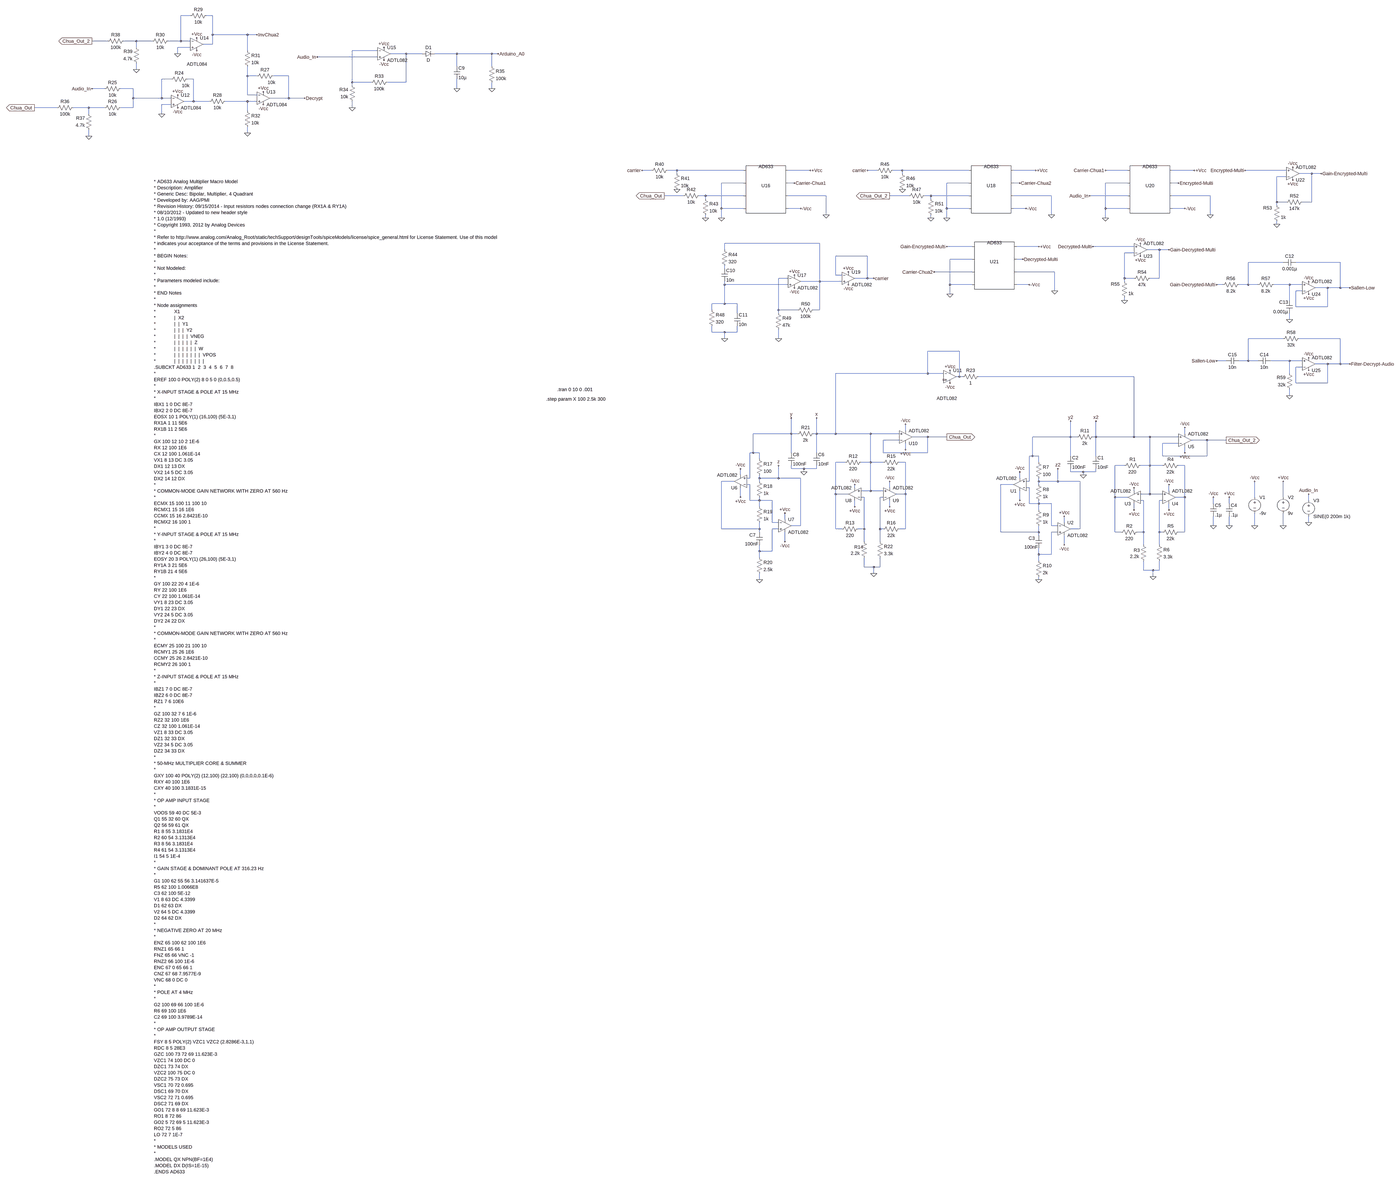
[diagram p0: schematic Chua.asc, whole sheet]
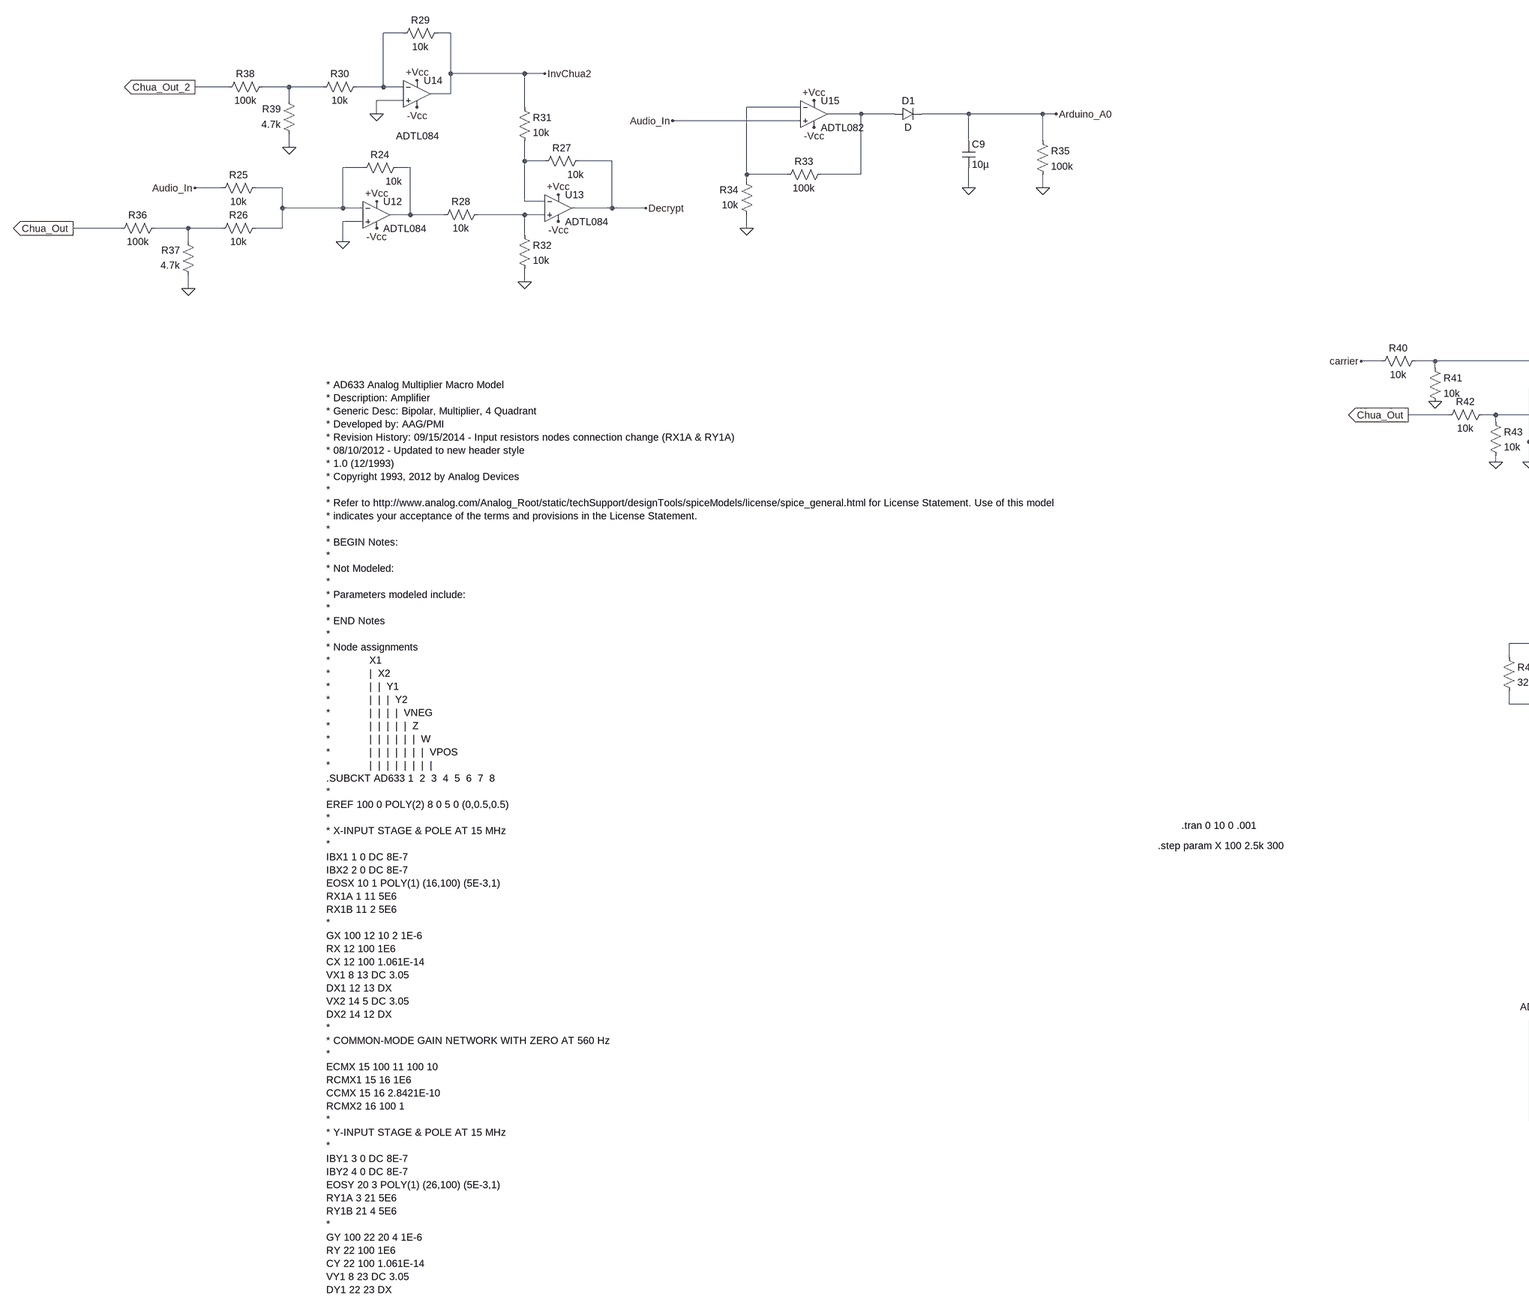
[diagram p1: schematic Chua.asc, part, row 1 of 2, column 1 of 2]
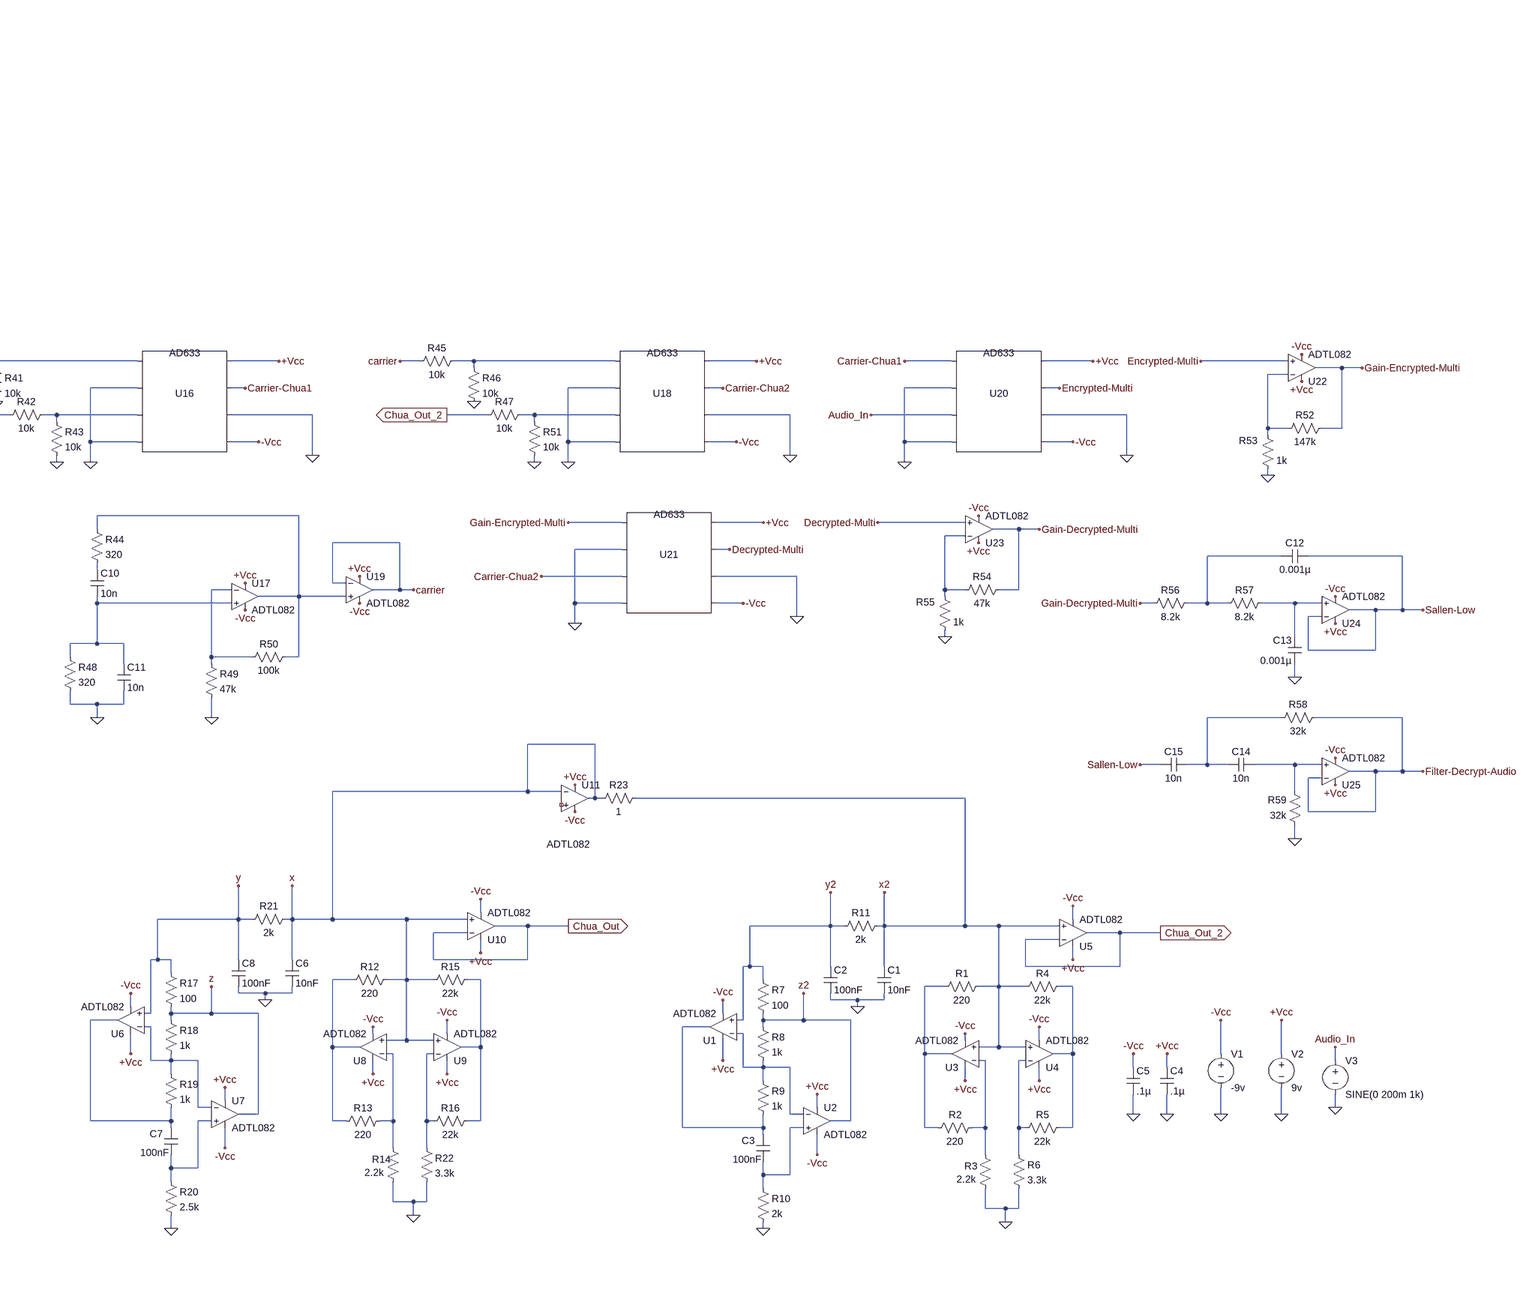
[diagram p2: schematic Chua.asc, part, row 1 of 2, column 2 of 2]
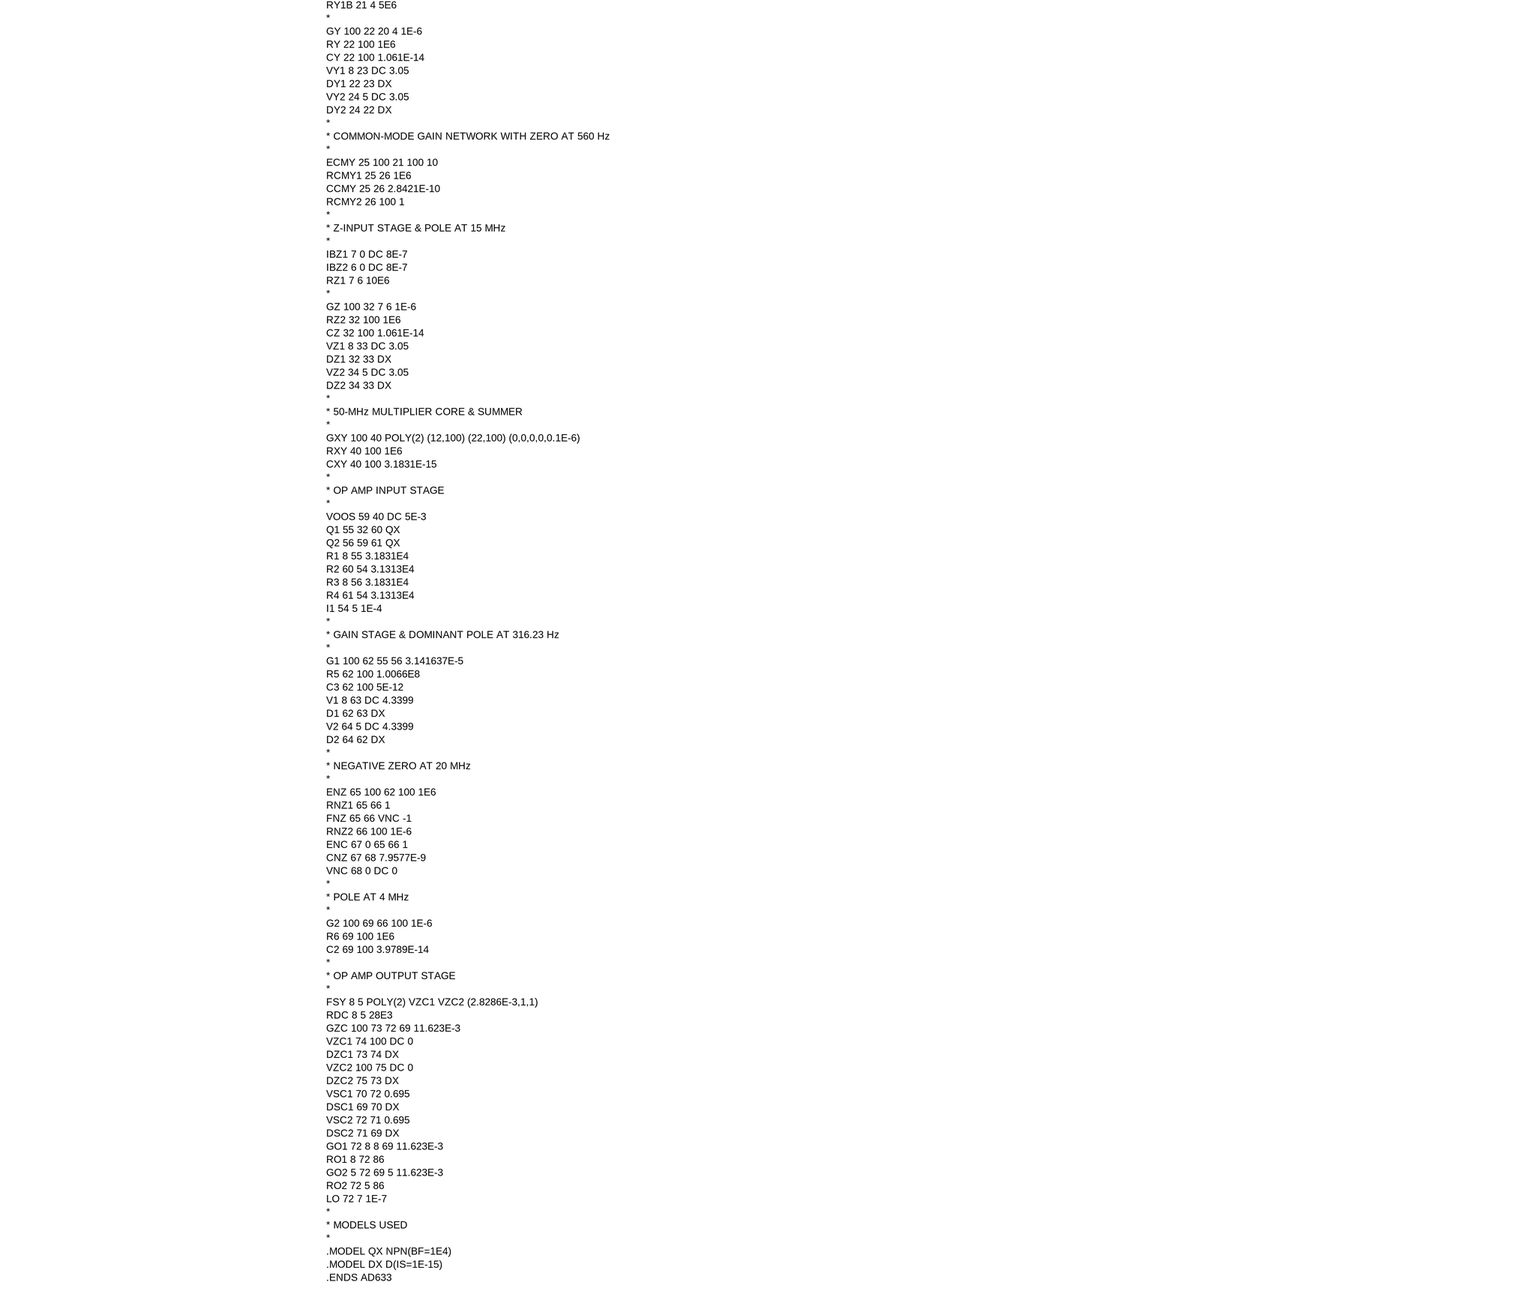
[diagram p3: schematic Chua.asc, part, row 2 of 2, column 1 of 2]
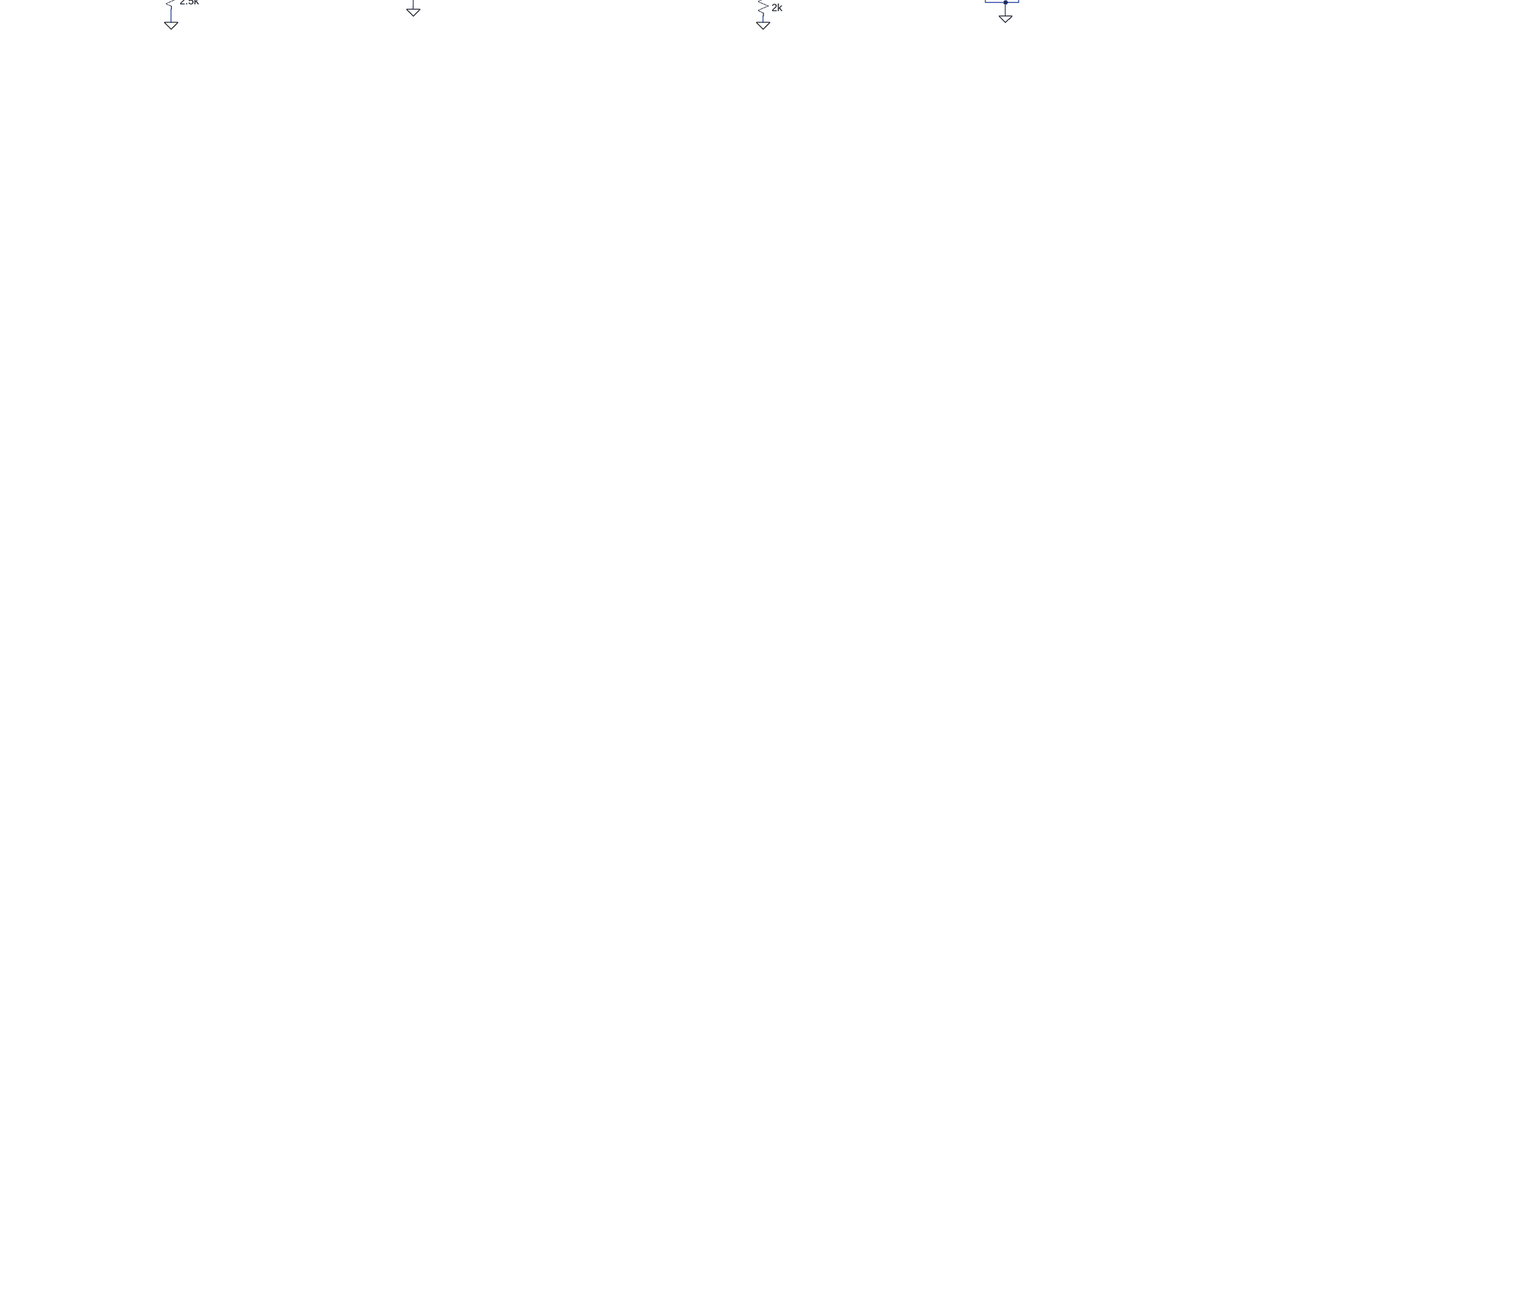
[diagram p4: schematic Chua.asc, part, row 2 of 2, column 2 of 2]
Chua.asc, the LTspice schematic file:
Version 4.1
SHEET 1 1936 3184
WIRE -5456 -2448 -5504 -2448
WIRE -5344 -2448 -5376 -2448
WIRE -5344 -2352 -5344 -2448
WIRE -5168 -2352 -5344 -2352
WIRE -5120 -2352 -5168 -2352
WIRE -5872 -2320 -5952 -2320
WIRE -5728 -2320 -5792 -2320
WIRE -5648 -2320 -5728 -2320
WIRE -5504 -2320 -5504 -2448
WIRE -5504 -2320 -5568 -2320
WIRE -5456 -2320 -5504 -2320
WIRE -5344 -2304 -5344 -2352
WIRE -5344 -2304 -5392 -2304
WIRE -5728 -2288 -5728 -2320
WIRE -5456 -2288 -5520 -2288
WIRE -5168 -2272 -5168 -2352
WIRE -4512 -2272 -4640 -2272
WIRE -5520 -2256 -5520 -2288
WIRE -4368 -2256 -4448 -2256
WIRE -4288 -2256 -4368 -2256
WIRE -4112 -2256 -4224 -2256
WIRE -3936 -2256 -4112 -2256
WIRE -3904 -2256 -3936 -2256
WIRE -4512 -2240 -4816 -2240
WIRE -4112 -2192 -4112 -2256
WIRE -3936 -2192 -3936 -2256
WIRE -5728 -2176 -5728 -2208
WIRE -5168 -2144 -5168 -2192
WIRE -5120 -2144 -5168 -2144
WIRE -4960 -2144 -5040 -2144
WIRE -5552 -2128 -5600 -2128
WIRE -5440 -2128 -5472 -2128
WIRE -4640 -2112 -4640 -2272
WIRE -4544 -2112 -4640 -2112
WIRE -4368 -2112 -4368 -2256
WIRE -4368 -2112 -4464 -2112
WIRE -4640 -2096 -4640 -2112
WIRE -5888 -2080 -5952 -2080
WIRE -5744 -2080 -5808 -2080
WIRE -4112 -2080 -4112 -2128
WIRE -3936 -2080 -3936 -2112
WIRE -5168 -2048 -5168 -2144
WIRE -5120 -2048 -5168 -2048
WIRE -5744 -2032 -5744 -2080
WIRE -5600 -2032 -5600 -2128
WIRE -5600 -2032 -5744 -2032
WIRE -5552 -2032 -5600 -2032
WIRE -4960 -2032 -4960 -2144
WIRE -4960 -2032 -5056 -2032
WIRE -4880 -2032 -4960 -2032
WIRE -5440 -2016 -5440 -2128
WIRE -5440 -2016 -5488 -2016
WIRE -5360 -2016 -5440 -2016
WIRE -5168 -2016 -5280 -2016
WIRE -5120 -2016 -5168 -2016
WIRE -5552 -2000 -5600 -2000
WIRE -6128 -1984 -6272 -1984
WIRE -5968 -1984 -6048 -1984
WIRE -5888 -1984 -5968 -1984
WIRE -5744 -1984 -5744 -2032
WIRE -5744 -1984 -5808 -1984
WIRE -4640 -1984 -4640 -2016
WIRE -5168 -1968 -5168 -2016
WIRE -5968 -1952 -5968 -1984
WIRE -5600 -1952 -5600 -2000
WIRE -5168 -1856 -5168 -1888
WIRE -5968 -1840 -5968 -1872
WIRE -1840 -1552 -1888 -1552
WIRE -1712 -1552 -1760 -1552
WIRE -1376 -1552 -1712 -1552
WIRE -1040 -1552 -1152 -1552
WIRE -704 -1552 -752 -1552
WIRE -576 -1552 -624 -1552
WIRE -240 -1552 -576 -1552
WIRE 96 -1552 -16 -1552
WIRE 560 -1552 448 -1552
WIRE 896 -1552 784 -1552
WIRE 1360 -1552 1152 -1552
WIRE -1712 -1536 -1712 -1552
WIRE -576 -1536 -576 -1552
WIRE 1488 -1536 1424 -1536
WIRE 1536 -1536 1488 -1536
WIRE 1360 -1520 1312 -1520
WIRE -1376 -1488 -1488 -1488
WIRE -1120 -1488 -1152 -1488
WIRE -240 -1488 -352 -1488
WIRE 16 -1488 -16 -1488
WIRE 560 -1488 448 -1488
WIRE 816 -1488 784 -1488
WIRE -1680 -1424 -1776 -1424
WIRE -1568 -1424 -1600 -1424
WIRE -1376 -1424 -1568 -1424
WIRE -960 -1424 -1152 -1424
WIRE -544 -1424 -640 -1424
WIRE -432 -1424 -464 -1424
WIRE -240 -1424 -432 -1424
WIRE 176 -1424 -16 -1424
WIRE 560 -1424 368 -1424
WIRE 976 -1424 784 -1424
WIRE -1568 -1408 -1568 -1424
WIRE -432 -1408 -432 -1424
WIRE 1312 -1392 1312 -1520
WIRE 1360 -1392 1312 -1392
WIRE 1488 -1392 1488 -1536
WIRE 1488 -1392 1440 -1392
WIRE 1312 -1376 1312 -1392
WIRE -1488 -1360 -1488 -1488
WIRE -1376 -1360 -1488 -1360
WIRE -1088 -1360 -1152 -1360
WIRE -352 -1360 -352 -1488
WIRE -240 -1360 -352 -1360
WIRE 48 -1360 -16 -1360
WIRE 448 -1360 448 -1488
WIRE 560 -1360 448 -1360
WIRE 848 -1360 784 -1360
WIRE -960 -1328 -960 -1424
WIRE 176 -1328 176 -1424
WIRE 976 -1328 976 -1424
WIRE -1568 -1312 -1568 -1328
WIRE -1488 -1312 -1488 -1360
WIRE -432 -1312 -432 -1328
WIRE -352 -1312 -352 -1360
WIRE 448 -1312 448 -1360
WIRE 1312 -1280 1312 -1296
WIRE -992 -1184 -1472 -1184
WIRE -224 -1168 -352 -1168
WIRE 112 -1168 0 -1168
WIRE 592 -1168 384 -1168
WIRE -1472 -1152 -1472 -1184
WIRE 720 -1152 656 -1152
WIRE 768 -1152 720 -1152
WIRE 592 -1136 544 -1136
WIRE -752 -1120 -912 -1120
WIRE -224 -1104 -336 -1104
WIRE 32 -1104 0 -1104
WIRE 1344 -1088 1168 -1088
WIRE 1632 -1088 1408 -1088
WIRE -1472 -1056 -1472 -1072
WIRE -224 -1040 -416 -1040
WIRE 192 -1040 0 -1040
WIRE -912 -1024 -912 -1120
WIRE -880 -1024 -912 -1024
WIRE -1152 -1008 -1200 -1008
WIRE -752 -1008 -752 -1120
WIRE -752 -1008 -816 -1008
WIRE -720 -1008 -752 -1008
WIRE 544 -1008 544 -1136
WIRE 592 -1008 544 -1008
WIRE 720 -1008 720 -1152
WIRE 720 -1008 672 -1008
WIRE -992 -992 -992 -1184
WIRE -992 -992 -1088 -992
WIRE -880 -992 -992 -992
WIRE 544 -992 544 -1008
WIRE -1472 -976 -1472 -992
WIRE -1152 -976 -1472 -976
WIRE -336 -976 -336 -1104
WIRE -224 -976 -336 -976
WIRE 64 -976 0 -976
WIRE 1040 -976 1008 -976
WIRE 1168 -976 1168 -1088
WIRE 1168 -976 1120 -976
WIRE 1216 -976 1168 -976
WIRE 1376 -976 1296 -976
WIRE 1440 -976 1376 -976
WIRE 1568 -960 1504 -960
WIRE 1632 -960 1632 -1088
WIRE 1632 -960 1568 -960
WIRE 1680 -960 1632 -960
WIRE 192 -944 192 -1040
WIRE 1440 -944 1408 -944
WIRE -336 -928 -336 -976
WIRE 544 -896 544 -912
WIRE 1376 -896 1376 -976
WIRE -1472 -880 -1472 -976
WIRE -1472 -880 -1536 -880
WIRE -1408 -880 -1472 -880
WIRE 1408 -864 1408 -944
WIRE 1568 -864 1568 -960
WIRE 1568 -864 1408 -864
WIRE -1536 -848 -1536 -880
WIRE -1200 -848 -1200 -1008
WIRE -1104 -848 -1200 -848
WIRE -992 -848 -992 -992
WIRE -992 -848 -1024 -848
WIRE -1408 -832 -1408 -880
WIRE -1200 -832 -1200 -848
WIRE 1376 -800 1376 -832
WIRE -1536 -736 -1536 -768
WIRE -1472 -736 -1536 -736
WIRE -1408 -736 -1408 -768
WIRE -1408 -736 -1472 -736
WIRE -1472 -704 -1472 -736
WIRE -1200 -704 -1200 -752
WIRE 1344 -704 1168 -704
WIRE 1632 -704 1424 -704
WIRE -288 -640 -448 -640
WIRE 1056 -592 1008 -592
WIRE 1168 -592 1168 -704
WIRE 1168 -592 1120 -592
WIRE 1216 -592 1168 -592
WIRE 1376 -592 1280 -592
WIRE 1440 -592 1376 -592
WIRE 1568 -576 1504 -576
WIRE 1632 -576 1632 -704
WIRE 1632 -576 1568 -576
WIRE 1680 -576 1632 -576
WIRE 1440 -560 1408 -560
WIRE -448 -528 -448 -640
WIRE -448 -528 -912 -528
WIRE -368 -528 -448 -528
WIRE 1376 -528 1376 -592
WIRE -288 -512 -288 -640
WIRE -288 -512 -304 -512
WIRE -272 -512 -288 -512
WIRE 592 -512 -192 -512
WIRE 1408 -480 1408 -560
WIRE 1568 -480 1568 -576
WIRE 1568 -480 1408 -480
WIRE 1376 -416 1376 -448
WIRE -560 -240 -560 -272
WIRE -1136 -224 -1136 -304
WIRE -1136 -224 -1328 -224
WIRE -1104 -224 -1136 -224
WIRE -1008 -224 -1008 -304
WIRE -1008 -224 -1024 -224
WIRE -912 -224 -912 -528
WIRE -912 -224 -1008 -224
WIRE -736 -224 -912 -224
WIRE -592 -224 -736 -224
WIRE 848 -224 848 -256
WIRE -448 -208 -528 -208
WIRE -352 -208 -448 -208
WIRE 272 -208 272 -288
WIRE 272 -208 80 -208
WIRE 304 -208 272 -208
WIRE 400 -208 400 -288
WIRE 400 -208 384 -208
WIRE 592 -208 592 -512
WIRE 592 -208 400 -208
WIRE 672 -208 592 -208
WIRE 816 -208 672 -208
WIRE -592 -192 -672 -192
WIRE 960 -192 880 -192
WIRE 1056 -192 960 -192
WIRE 816 -176 736 -176
WIRE -560 -144 -560 -176
WIRE -1328 -128 -1328 -224
WIRE -1328 -128 -1344 -128
WIRE -1296 -128 -1328 -128
WIRE -1136 -128 -1136 -224
WIRE -1008 -128 -1008 -224
WIRE -672 -128 -672 -192
WIRE -448 -128 -448 -208
WIRE -448 -128 -672 -128
WIRE 848 -128 848 -160
WIRE 80 -112 80 -208
WIRE 80 -112 64 -112
WIRE 112 -112 80 -112
WIRE 272 -112 272 -208
WIRE 400 -112 400 -208
WIRE 736 -112 736 -176
WIRE 960 -112 960 -192
WIRE 960 -112 736 -112
WIRE -1296 -96 -1296 -128
WIRE -864 -80 -912 -80
WIRE -736 -80 -736 -224
WIRE -736 -80 -784 -80
WIRE -672 -80 -736 -80
WIRE -560 -80 -592 -80
WIRE 112 -80 112 -112
WIRE 544 -64 496 -64
WIRE 672 -64 672 -208
WIRE 672 -64 624 -64
WIRE 736 -64 672 -64
WIRE 848 -64 816 -64
WIRE -1136 -48 -1136 -64
WIRE -1072 -48 -1136 -48
WIRE -1008 -48 -1008 -64
WIRE -1008 -48 -1072 -48
WIRE -1072 -32 -1072 -48
WIRE 272 -32 272 -48
WIRE 336 -32 272 -32
WIRE 400 -32 400 -48
WIRE 400 -32 336 -32
WIRE -1392 -16 -1392 -48
WIRE 336 -16 336 -32
WIRE -1344 0 -1344 -128
WIRE -1344 0 -1360 0
WIRE -1296 0 -1296 -16
WIRE -1200 0 -1200 -64
WIRE -1200 0 -1296 0
WIRE -1088 0 -1200 0
WIRE 16 0 16 -32
WIRE -1424 16 -1488 16
WIRE -1296 16 -1296 0
WIRE 64 16 64 -112
WIRE 64 16 48 16
WIRE 112 16 112 0
WIRE 208 16 208 -48
WIRE 208 16 112 16
WIRE 320 16 208 16
WIRE -1344 32 -1360 32
WIRE -16 32 -80 32
WIRE 112 32 112 16
WIRE -816 48 -816 32
WIRE -640 48 -640 16
WIRE 64 48 48 48
WIRE -736 64 -736 -80
WIRE -736 64 -784 64
WIRE -672 64 -736 64
WIRE 592 64 592 48
WIRE 768 64 768 32
WIRE -912 80 -912 -80
WIRE -848 80 -912 80
WIRE -560 80 -560 -80
WIRE -560 80 -608 80
WIRE 672 80 672 -64
WIRE 672 80 624 80
WIRE 736 80 672 80
WIRE -1392 96 -1392 48
WIRE -768 96 -784 96
WIRE -672 96 -688 96
WIRE 496 96 496 -64
WIRE 560 96 496 96
WIRE 848 96 848 -64
WIRE 848 96 800 96
WIRE 1200 96 1200 16
WIRE 1344 96 1344 16
WIRE -1344 112 -1344 32
WIRE -1296 112 -1296 96
WIRE -1296 112 -1344 112
WIRE -1232 112 -1296 112
WIRE 16 112 16 64
WIRE 640 112 624 112
WIRE 736 112 720 112
WIRE 1472 112 1472 80
WIRE 64 128 64 48
WIRE 112 128 112 112
WIRE 112 128 64 128
WIRE 176 128 112 128
WIRE 992 128 992 96
WIRE 1072 128 1072 96
WIRE -1296 144 -1296 112
WIRE -816 144 -816 112
WIRE -640 144 -640 112
WIRE 112 160 112 128
WIRE 592 160 592 128
WIRE 768 160 768 128
WIRE -1168 208 -1168 176
WIRE -1232 224 -1232 112
WIRE -1200 224 -1232 224
WIRE 240 224 240 192
WIRE 1472 224 1472 192
WIRE -1088 240 -1088 0
WIRE -1088 240 -1136 240
WIRE 176 240 176 128
WIRE 208 240 176 240
WIRE 992 240 992 192
WIRE 1072 240 1072 192
WIRE 1200 240 1200 176
WIRE 1344 240 1344 176
WIRE -1488 256 -1488 16
WIRE -1296 256 -1296 224
WIRE -1296 256 -1488 256
WIRE -1200 256 -1232 256
WIRE -912 256 -912 80
WIRE -880 256 -912 256
WIRE -768 256 -768 96
WIRE -768 256 -800 256
WIRE -688 256 -688 96
WIRE -672 256 -688 256
WIRE -560 256 -560 80
WIRE -560 256 -592 256
WIRE 320 256 320 16
WIRE 320 256 272 256
WIRE -1296 272 -1296 256
WIRE -80 272 -80 32
WIRE 112 272 112 240
WIRE 112 272 -80 272
WIRE 208 272 176 272
WIRE 496 272 496 96
WIRE 528 272 496 272
WIRE 640 272 640 112
WIRE 640 272 608 272
WIRE 720 272 720 112
WIRE 736 272 720 272
WIRE 848 272 848 96
WIRE 848 272 816 272
WIRE 112 288 112 272
WIRE -1168 320 -1168 272
WIRE -768 320 -768 256
WIRE -688 320 -688 256
WIRE 240 336 240 288
WIRE 640 336 640 272
WIRE 720 336 720 272
WIRE -1296 368 -1296 336
WIRE -1232 368 -1232 256
WIRE -1232 368 -1296 368
WIRE 112 384 112 352
WIRE 176 384 176 272
WIRE 176 384 112 384
WIRE -1296 400 -1296 368
WIRE 112 416 112 384
WIRE -768 448 -768 400
WIRE -720 448 -768 448
WIRE -688 448 -688 400
WIRE -688 448 -720 448
WIRE 640 464 640 416
WIRE 688 464 640 464
WIRE 720 464 720 416
WIRE 720 464 688 464
WIRE -720 480 -720 448
WIRE 688 496 688 464
WIRE -1296 512 -1296 480
WIRE 112 512 112 496
FLAG 112 512 0
FLAG 336 -16 0
FLAG 688 496 0
FLAG 1056 -192 Chua_Out_2
IOPIN 1056 -192 Out
FLAG 1072 240 0
FLAG 1072 96 +Vcc
FLAG 1200 240 0
FLAG 1200 16 -Vcc
FLAG 992 240 0
FLAG 992 96 -Vcc
FLAG 1344 240 0
FLAG 1344 16 +Vcc
FLAG 592 160 +Vcc
FLAG 768 160 +Vcc
FLAG 848 -128 +Vcc
FLAG 16 112 +Vcc
FLAG 240 192 +Vcc
FLAG 768 32 -Vcc
FLAG 848 -256 -Vcc
FLAG 16 -32 -Vcc
FLAG 240 336 -Vcc
FLAG 592 48 -Vcc
FLAG 400 -288 x2
FLAG 272 -288 y2
FLAG 208 -48 z2
FLAG -1296 512 0
FLAG -1072 -32 0
FLAG -720 480 0
FLAG -352 -208 Chua_Out
IOPIN -352 -208 Out
FLAG -816 144 +Vcc
FLAG -640 144 +Vcc
FLAG -560 -144 +Vcc
FLAG -1392 96 +Vcc
FLAG -1168 176 +Vcc
FLAG -640 16 -Vcc
FLAG -560 -272 -Vcc
FLAG -1392 -48 -Vcc
FLAG -1168 320 -Vcc
FLAG -816 32 -Vcc
FLAG -1008 -304 x
FLAG -1136 -304 y
FLAG -1200 -64 z
FLAG -336 -480 -Vcc
FLAG -336 -544 +Vcc
FLAG -5600 -1952 0
FLAG -5520 -2256 0
FLAG -5168 -1856 0
FLAG -4880 -2032 Decrypt
FLAG 1472 224 0
FLAG -5520 -1984 -Vcc
FLAG -5088 -2000 -Vcc
FLAG -5424 -2272 -Vcc
FLAG -5520 -2048 +Vcc
FLAG -5088 -2064 +Vcc
FLAG -5424 -2336 +Vcc
FLAG -5952 -2320 Chua_Out_2
IOPIN -5952 -2320 Out
FLAG -6272 -1984 Chua_Out
IOPIN -6272 -1984 Out
FLAG 1472 80 Audio_In
FLAG -5952 -2080 Audio_In
FLAG -4640 -1984 0
FLAG -4112 -2080 0
FLAG -3936 -2080 0
FLAG -4816 -2240 Audio_In
FLAG -4480 -2288 +Vcc
FLAG -4480 -2224 -Vcc
FLAG -3904 -2256 Arduino_A0
FLAG -5968 -1840 0
FLAG -5728 -2176 0
FLAG -5120 -2352 InvChua2
FLAG -1200 -704 0
FLAG -1472 -704 0
FLAG -1120 -960 -Vcc
FLAG -1120 -1024 +Vcc
FLAG -720 -1008 carrier
FLAG -1488 -1312 0
FLAG -960 -1328 0
FLAG -1888 -1552 carrier
FLAG -1040 -1552 +Vcc
FLAG -1088 -1360 -Vcc
FLAG -1568 -1312 0
FLAG -1776 -1424 Chua_Out
IOPIN -1776 -1424 Out
FLAG -1712 -1456 0
FLAG -1120 -1488 Carrier-Chua1
FLAG -352 -1312 0
FLAG 176 -1328 0
FLAG -752 -1552 carrier
FLAG 96 -1552 +Vcc
FLAG 48 -1360 -Vcc
FLAG -432 -1312 0
FLAG -576 -1456 0
FLAG 16 -1488 Carrier-Chua2
FLAG -640 -1424 Chua_Out_2
IOPIN -640 -1424 Out
FLAG -848 -1040 +Vcc
FLAG -848 -976 -Vcc
FLAG 448 -1312 0
FLAG 976 -1328 0
FLAG 896 -1552 +Vcc
FLAG 848 -1360 -Vcc
FLAG 816 -1488 Encrypted-Multi
FLAG -336 -928 0
FLAG 192 -944 0
FLAG 112 -1168 +Vcc
FLAG 64 -976 -Vcc
FLAG 32 -1104 Decrypted-Multi
FLAG 448 -1552 Carrier-Chua1
FLAG 368 -1424 Audio_In
FLAG 1152 -1552 Encrypted-Multi
FLAG 1392 -1504 +Vcc
FLAG 1392 -1568 -Vcc
FLAG 1312 -1280 0
FLAG 1536 -1536 Gain-Encrypted-Multi
FLAG -352 -1168 Gain-Encrypted-Multi
FLAG -416 -1040 Carrier-Chua2
FLAG 624 -1120 +Vcc
FLAG 624 -1184 -Vcc
FLAG 544 -896 0
FLAG 384 -1168 Decrypted-Multi
FLAG 768 -1152 Gain-Decrypted-Multi
FLAG 1472 -992 -Vcc
FLAG 1472 -928 +Vcc
FLAG 1376 -800 0
FLAG 1680 -960 Sallen-Low
FLAG 1008 -976 Gain-Decrypted-Multi
FLAG 1472 -608 -Vcc
FLAG 1472 -544 +Vcc
FLAG 1376 -416 0
FLAG 1680 -576 Filter-Decrypt-Audio
FLAG 1008 -592 Sallen-Low
SYMBOL OpAmps\\ADTL082 16 96 R180
SYMATTR InstName U1
SYMBOL OpAmps\\ADTL082 240 192 R0
SYMATTR InstName U2
SYMBOL OpAmps\\ADTL082 592 160 R180
SYMATTR InstName U3
SYMBOL OpAmps\\ADTL082 768 160 M180
SYMATTR InstName U4
SYMBOL OpAmps\\ADTL082 848 -128 M180
SYMATTR InstName U5
SYMBOL res 640 -80 R90
WINDOW 0 0 56 VBottom 2
WINDOW 3 32 56 VTop 2
SYMATTR InstName R1
SYMATTR Value 220
SYMATTR SpiceLine tol=1
SYMBOL res 512 288 R270
WINDOW 0 32 56 VTop 2
WINDOW 3 0 56 VBottom 2
SYMATTR InstName R2
SYMATTR Value 220
SYMATTR SpiceLine tol=1
SYMBOL res 624 320 R0
WINDOW 0 -34 43 Left 2
WINDOW 3 -52 74 Left 2
SYMATTR InstName R3
SYMATTR Value 2.2k
SYMBOL res 832 -80 R90
WINDOW 0 0 56 VBottom 2
WINDOW 3 32 56 VTop 2
SYMATTR InstName R4
SYMATTR Value 22k
SYMATTR SpiceLine tol=1
SYMBOL res 832 256 R90
WINDOW 0 0 56 VBottom 2
WINDOW 3 32 56 VTop 2
SYMATTR InstName R5
SYMATTR Value 22k
SYMATTR SpiceLine tol=1
SYMBOL res 96 -96 R0
SYMATTR InstName R7
SYMATTR Value 100
SYMATTR SpiceLine tol=1
SYMBOL res 96 16 R0
SYMATTR InstName R8
SYMATTR Value 1k
SYMATTR SpiceLine tol=1
SYMBOL res 96 144 R0
SYMATTR InstName R9
SYMATTR Value 1k
SYMATTR SpiceLine tol=1
SYMBOL cap 384 -112 R0
SYMATTR InstName C1
SYMATTR Value 10nF
SYMBOL cap 96 288 R0
WINDOW 0 -35 14 Left 2
WINDOW 3 -57 59 Left 2
SYMATTR InstName C3
SYMATTR Value 100nF
SYMBOL res 96 400 R0
SYMATTR InstName R10
SYMATTR Value 2k
SYMATTR SpiceLine tol=1
SYMBOL res 400 -224 R90
WINDOW 0 0 56 VBottom 2
WINDOW 3 32 56 VTop 2
SYMATTR InstName R11
SYMATTR Value 2k
SYMATTR SpiceLine tol=1
SYMBOL cap 256 -112 R0
SYMATTR InstName C2
SYMATTR Value 100nF
SYMBOL cap 1056 128 R0
SYMATTR InstName C4
SYMATTR Value .1µ
SYMBOL voltage 1200 80 R0
WINDOW 123 0 0 Left 0
WINDOW 39 0 0 Left 0
SYMATTR InstName V1
SYMATTR Value -9v
SYMBOL cap 976 128 R0
SYMATTR InstName C5
SYMATTR Value .1µ
SYMBOL voltage 1344 80 R0
WINDOW 123 0 0 Left 0
WINDOW 39 0 0 Left 0
SYMATTR InstName V2
SYMATTR Value 9v
SYMBOL res 704 320 R0
SYMATTR InstName R6
SYMATTR Value 3.3k
SYMBOL OpAmps\\ADTL082 -1392 80 R180
SYMATTR InstName U6
SYMBOL OpAmps\\ADTL082 -1168 176 R0
SYMATTR InstName U7
SYMBOL OpAmps\\ADTL082 -816 144 R180
SYMATTR InstName U8
SYMBOL OpAmps\\ADTL082 -640 144 M180
SYMATTR InstName U9
SYMBOL OpAmps\\ADTL082 -560 -144 M180
SYMATTR InstName U10
SYMBOL res -768 -96 R90
WINDOW 0 0 56 VBottom 2
WINDOW 3 32 56 VTop 2
SYMATTR InstName R12
SYMATTR Value 220
SYMATTR SpiceLine tol=1
SYMBOL res -896 272 R270
WINDOW 0 32 56 VTop 2
WINDOW 3 0 56 VBottom 2
SYMATTR InstName R13
SYMATTR Value 220
SYMATTR SpiceLine tol=1
SYMBOL res -784 304 R0
WINDOW 0 -34 43 Left 2
WINDOW 3 -52 74 Left 2
SYMATTR InstName R14
SYMATTR Value 2.2k
SYMBOL res -576 -96 R90
WINDOW 0 0 56 VBottom 2
WINDOW 3 32 56 VTop 2
SYMATTR InstName R15
SYMATTR Value 22k
SYMATTR SpiceLine tol=1
SYMBOL res -576 240 R90
WINDOW 0 0 56 VBottom 2
WINDOW 3 32 56 VTop 2
SYMATTR InstName R16
SYMATTR Value 22k
SYMATTR SpiceLine tol=1
SYMBOL res -1312 -112 R0
SYMATTR InstName R17
SYMATTR Value 100
SYMATTR SpiceLine tol=1
SYMBOL res -1312 0 R0
SYMATTR InstName R18
SYMATTR Value 1k
SYMATTR SpiceLine tol=1
SYMBOL res -1312 128 R0
SYMATTR InstName R19
SYMATTR Value 1k
SYMATTR SpiceLine tol=1
SYMBOL cap -1024 -128 R0
SYMATTR InstName C6
SYMATTR Value 10nF
SYMBOL cap -1312 272 R0
WINDOW 0 -35 14 Left 2
WINDOW 3 -57 59 Left 2
SYMATTR InstName C7
SYMATTR Value 100nF
SYMBOL res -1312 384 R0
SYMATTR InstName R20
SYMATTR Value 2.5k
SYMATTR SpiceLine tol=1
SYMBOL res -1008 -240 R90
WINDOW 0 0 56 VBottom 2
WINDOW 3 32 56 VTop 2
SYMATTR InstName R21
SYMATTR Value 2k
SYMATTR SpiceLine tol=1
SYMBOL cap -1152 -128 R0
SYMATTR InstName C8
SYMATTR Value 100nF
SYMBOL res -704 304 R0
SYMATTR InstName R22
SYMATTR Value 3.3k
SYMBOL OpAmps\\ADTL082 -336 -576 R0
WINDOW 3 -67 173 Left 2
SYMATTR InstName U11
SYMBOL res -176 -528 R90
WINDOW 0 0 56 VBottom 2
WINDOW 3 32 56 VTop 2
SYMATTR InstName R23
SYMATTR Value 1
SYMBOL OpAmps\\ADTL084 -5520 -2080 R0
SYMATTR InstName U12
SYMBOL OpAmps\\ADTL084 -5088 -2096 R0
SYMATTR InstName U13
SYMBOL OpAmps\\ADTL084 -5424 -2368 R0
WINDOW 3 -50 164 Left 2
SYMATTR InstName U14
SYMBOL res -5456 -2144 R90
WINDOW 0 0 56 VBottom 2
WINDOW 3 32 23 VTop 2
SYMATTR InstName R24
SYMATTR Value 10k
SYMBOL res -5792 -2096 R90
WINDOW 0 0 56 VBottom 2
WINDOW 3 32 56 VTop 2
SYMATTR InstName R25
SYMATTR Value 10k
SYMBOL res -5792 -2000 R90
WINDOW 0 0 56 VBottom 2
WINDOW 3 32 56 VTop 2
SYMATTR InstName R26
SYMATTR Value 10k
SYMBOL res -5024 -2160 R90
WINDOW 0 0 56 VBottom 2
WINDOW 3 32 23 VTop 2
SYMATTR InstName R27
SYMATTR Value 10k
SYMBOL res -5264 -2032 R90
WINDOW 0 0 56 VBottom 2
WINDOW 3 32 56 VTop 2
SYMATTR InstName R28
SYMATTR Value 10k
SYMBOL res -5360 -2464 R90
WINDOW 0 0 56 VBottom 2
WINDOW 3 32 56 VTop 2
SYMATTR InstName R29
SYMATTR Value 10k
SYMBOL res -5552 -2336 R90
WINDOW 0 0 56 VBottom 2
WINDOW 3 32 56 VTop 2
SYMATTR InstName R30
SYMATTR Value 10k
SYMBOL res -5184 -2288 R0
SYMATTR InstName R31
SYMATTR Value 10k
SYMBOL res -5184 -1984 R0
SYMATTR InstName R32
SYMATTR Value 10k
SYMBOL voltage 1472 96 R0
WINDOW 123 0 0 Left 0
WINDOW 39 0 0 Left 0
SYMATTR InstName V3
SYMATTR Value SINE(0 200m 1k)
SYMBOL OpAmps\\ADTL082 -4480 -2320 R0
SYMATTR InstName U15
SYMBOL res -4448 -2128 R90
WINDOW 0 0 56 VBottom 2
WINDOW 3 32 56 VTop 2
SYMATTR InstName R33
SYMATTR Value 100k
SYMBOL res -4624 -2000 R180
WINDOW 0 36 76 Left 2
WINDOW 3 36 40 Left 2
SYMATTR InstName R34
SYMATTR Value 10k
SYMBOL diode -4288 -2240 R270
WINDOW 0 32 32 VTop 2
WINDOW 3 0 32 VBottom 2
SYMATTR InstName D1
SYMBOL cap -4128 -2192 R0
SYMATTR InstName C9
SYMATTR Value 10µ
SYMBOL res -3952 -2208 R0
SYMATTR InstName R35
SYMATTR Value 100k
SYMBOL res -6032 -2000 R90
WINDOW 0 0 56 VBottom 2
WINDOW 3 32 56 VTop 2
SYMATTR InstName R36
SYMATTR Value 100k
SYMBOL res -5952 -1856 R180
WINDOW 0 36 76 Left 2
WINDOW 3 36 40 Left 2
SYMATTR InstName R37
SYMATTR Value 4.7k
SYMBOL res -5776 -2336 R90
WINDOW 0 0 56 VBottom 2
WINDOW 3 32 56 VTop 2
SYMATTR InstName R38
SYMATTR Value 100k
SYMBOL res -5712 -2192 R180
WINDOW 0 36 76 Left 2
WINDOW 3 36 40 Left 2
SYMATTR InstName R39
SYMATTR Value 4.7k
SYMBOL cap -1488 -1056 R0
SYMATTR InstName C10
SYMATTR Value 10n
SYMBOL res -1488 -1168 R0
SYMATTR InstName R44
SYMATTR Value 320
SYMBOL res -1552 -864 R0
SYMATTR InstName R48
SYMATTR Value 320
SYMBOL cap -1424 -832 R0
SYMATTR InstName C11
SYMATTR Value 10n
SYMBOL res -1216 -848 R0
SYMATTR InstName R49
SYMATTR Value 47k
SYMBOL res -1008 -864 R90
WINDOW 0 0 56 VBottom 2
WINDOW 3 32 56 VTop 2
SYMATTR InstName R50
SYMATTR Value 100k
SYMBOL OpAmps\\ADTL082 -1120 -1056 R0
SYMATTR InstName U17
SYMBOL Misc\\DIP8 -1264 -1456 R0
WINDOW 3 0 -116 Center 2
SYMATTR Value AD633
SYMATTR InstName U16
SYMBOL res -1744 -1568 R90
WINDOW 0 0 56 VBottom 2
WINDOW 3 32 56 VTop 2
SYMATTR InstName R40
SYMATTR Value 10k
SYMBOL res -1728 -1552 R0
SYMATTR InstName R41
SYMATTR Value 10k
SYMBOL res -1584 -1440 R90
WINDOW 0 0 56 VBottom 2
WINDOW 3 32 56 VTop 2
SYMATTR InstName R42
SYMATTR Value 10k
SYMBOL res -1584 -1424 R0
SYMATTR InstName R43
SYMATTR Value 10k
SYMBOL Misc\\DIP8 -128 -1456 R0
WINDOW 3 0 -116 Center 2
SYMATTR Value AD633
SYMATTR InstName U18
SYMBOL res -608 -1568 R90
WINDOW 0 0 56 VBottom 2
WINDOW 3 32 56 VTop 2
SYMATTR InstName R45
SYMATTR Value 10k
SYMBOL res -592 -1552 R0
SYMATTR InstName R46
SYMATTR Value 10k
SYMBOL res -448 -1440 R90
WINDOW 0 0 56 VBottom 2
WINDOW 3 32 56 VTop 2
SYMATTR InstName R47
SYMATTR Value 10k
SYMBOL res -448 -1424 R0
SYMATTR InstName R51
SYMATTR Value 10k
SYMBOL OpAmps\\ADTL082 -848 -1072 R0
SYMATTR InstName U19
SYMBOL Misc\\DIP8 672 -1456 R0
WINDOW 3 0 -116 Center 2
SYMATTR Value AD633
SYMATTR InstName U20
SYMBOL Misc\\DIP8 -112 -1072 R0
WINDOW 3 0 -116 Center 2
SYMATTR Value AD633
SYMATTR InstName U21
SYMBOL OpAmps\\ADTL082 1392 -1472 M180
SYMATTR InstName U22
SYMBOL res 1456 -1408 R90
WINDOW 0 0 56 VBottom 2
WINDOW 3 32 56 VTop 2
SYMATTR InstName R52
SYMATTR Value 147k
SYMBOL res 1296 -1392 R0
WINDOW 0 -53 29 Left 2
SYMATTR InstName R53
SYMATTR Value 1k
SYMBOL OpAmps\\ADTL082 624 -1088 M180
SYMATTR InstName U23
SYMBOL res 688 -1024 R90
WINDOW 0 0 56 VBottom 2
WINDOW 3 32 56 VTop 2
SYMATTR InstName R54
SYMATTR Value 47k
SYMBOL res 528 -1008 R0
WINDOW 0 -53 29 Left 2
SYMATTR InstName R55
SYMATTR Value 1k
SYMBOL OpAmps\\ADTL082 1472 -896 M180
SYMATTR InstName U24
SYMBOL res 1312 -992 R90
WINDOW 0 0 56 VBottom 2
WINDOW 3 32 56 VTop 2
SYMATTR InstName R57
SYMATTR Value 8.2k
SYMBOL cap 1408 -1104 R90
WINDOW 0 0 32 VBottom 2
WINDOW 3 32 32 VTop 2
SYMATTR InstName C12
SYMATTR Value 0.001µ
SYMBOL cap 1392 -832 R180
WINDOW 0 24 56 Left 2
WINDOW 3 24 8 Left 2
SYMATTR InstName C13
SYMATTR Value 0.001µ
SYMBOL res 1136 -992 R90
WINDOW 0 0 56 VBottom 2
WINDOW 3 32 56 VTop 2
SYMATTR InstName R56
SYMATTR Value 8.2k
SYMBOL OpAmps\\ADTL082 1472 -512 M180
SYMATTR InstName U25
SYMBOL res 1440 -720 R90
WINDOW 0 0 56 VBottom 2
WINDOW 3 32 56 VTop 2
SYMATTR InstName R58
SYMATTR Value 32k
SYMBOL res 1392 -432 R180
WINDOW 0 36 76 Left 2
WINDOW 3 36 40 Left 2
SYMATTR InstName R59
SYMATTR Value 32k
SYMBOL cap 1280 -608 R90
WINDOW 0 0 32 VBottom 2
WINDOW 3 32 32 VTop 2
SYMATTR InstName C14
SYMATTR Value 10n
SYMBOL cap 1120 -608 R90
WINDOW 0 0 32 VBottom 2
WINDOW 3 32 32 VTop 2
SYMATTR InstName C15
SYMATTR Value 10n
TEXT -3032 -448 Left 2 !.tran 0 10 0 .001
TEXT -3088 -400 Left 2 !.step param X 100 2.5k 300
TEXT -5640 -1496 Left 2 !* AD633 Analog Multiplier Macro Model\n* Description: Amplifier\n* Generic Desc: Bipolar, Multiplier, 4 Quadrant\n* Developed by: AAG/PMI\n* Revision History: 09/15/2014 - Input resistors nodes connection change (RX1A & RY1A)\n* 08/10/2012 - Updated to new header style\n* 1.0 (12/1993)\n* Copyright 1993, 2012 by Analog Devices\n*\n* Refer to http://www.analog.com/Analog_Root/static/techSupport/designTools/spiceModels/license/spice_general.html for License Statement. Use of this model\n* indicates your acceptance of the terms and provisions in the License Statement.\n*\n* BEGIN Notes:\n*\n* Not Modeled:\n*\n* Parameters modeled include:\n*\n* END Notes\n*\n* Node assignments\n*             X1\n*             |  X2\n*             |  |  Y1\n*             |  |  |  Y2\n*             |  |  |  |  VNEG\n*             |  |  |  |  |  Z\n*             |  |  |  |  |  |  W\n*             |  |  |  |  |  |  |  VPOS\n*             |  |  |  |  |  |  |  |\n.SUBCKT AD633 1  2  3  4  5  6  7  8\n*\nEREF 100 0 POLY(2) 8 0 5 0 (0,0.5,0.5)\n*\n* X-INPUT STAGE & POLE AT 15 MHz\n*\nIBX1 1 0 DC 8E-7\nIBX2 2 0 DC 8E-7\nEOSX 10 1 POLY(1) (16,100) (5E-3,1)\nRX1A 1 11 5E6\nRX1B 11 2 5E6\n*\nGX 100 12 10 2 1E-6\nRX 12 100 1E6\nCX 12 100 1.061E-14\nVX1 8 13 DC 3.05\nDX1 12 13 DX\nVX2 14 5 DC 3.05\nDX2 14 12 DX\n*\n* COMMON-MODE GAIN NETWORK WITH ZERO AT 560 Hz\n*\nECMX 15 100 11 100 10\nRCMX1 15 16 1E6\nCCMX 15 16 2.8421E-10\nRCMX2 16 100 1\n*\n* Y-INPUT STAGE & POLE AT 15 MHz\n*\nIBY1 3 0 DC 8E-7\nIBY2 4 0 DC 8E-7\nEOSY 20 3 POLY(1) (26,100) (5E-3,1)\nRY1A 3 21 5E6\nRY1B 21 4 5E6\n*\nGY 100 22 20 4 1E-6\nRY 22 100 1E6\nCY 22 100 1.061E-14\nVY1 8 23 DC 3.05\nDY1 22 23 DX\nVY2 24 5 DC 3.05\nDY2 24 22 DX\n*\n* COMMON-MODE GAIN NETWORK WITH ZERO AT 560 Hz\n*\nECMY 25 100 21 100 10\nRCMY1 25 26 1E6\nCCMY 25 26 2.8421E-10\nRCMY2 26 100 1\n*\n* Z-INPUT STAGE & POLE AT 15 MHz\n*\nIBZ1 7 0 DC 8E-7\nIBZ2 6 0 DC 8E-7\nRZ1 7 6 10E6\n*\nGZ 100 32 7 6 1E-6\nRZ2 32 100 1E6\nCZ 32 100 1.061E-14\nVZ1 8 33 DC 3.05\nDZ1 32 33 DX\nVZ2 34 5 DC 3.05\nDZ2 34 33 DX\n*\n* 50-MHz MULTIPLIER CORE & SUMMER\n*\nGXY 100 40 POLY(2) (12,100) (22,100) (0,0,0,0,0.1E-6)\nRXY 40 100 1E6\nCXY 40 100 3.1831E-15\n*\n* OP AMP INPUT STAGE\n*\nVOOS 59 40 DC 5E-3\nQ1 55 32 60 QX\nQ2 56 59 61 QX\nR1 8 55 3.1831E4\nR2 60 54 3.1313E4\nR3 8 56 3.1831E4\nR4 61 54 3.1313E4\nI1 54 5 1E-4\n*\n* GAIN STAGE & DOMINANT POLE AT 316.23 Hz\n*\nG1 100 62 55 56 3.141637E-5\nR5 62 100 1.0066E8\nC3 62 100 5E-12\nV1 8 63 DC 4.3399\nD1 62 63 DX\nV2 64 5 DC 4.3399\nD2 64 62 DX\n*\n* NEGATIVE ZERO AT 20 MHz\n*\nENZ 65 100 62 100 1E6\nRNZ1 65 66 1\nFNZ 65 66 VNC -1\nRNZ2 66 100 1E-6\nENC 67 0 65 66 1\nCNZ 67 68 7.9577E-9\nVNC 68 0 DC 0\n*\n* POLE AT 4 MHz\n*\nG2 100 69 66 100 1E-6\nR6 69 100 1E6\nC2 69 100 3.9789E-14\n*\n* OP AMP OUTPUT STAGE\n*\nFSY 8 5 POLY(2) VZC1 VZC2 (2.8286E-3,1,1)\nRDC 8 5 28E3\nGZC 100 73 72 69 11.623E-3\nVZC1 74 100 DC 0\nDZC1 73 74 DX\nVZC2 100 75 DC 0\nDZC2 75 73 DX\nVSC1 70 72 0.695\nDSC1 69 70 DX\nVSC2 72 71 0.695\nDSC2 71 69 DX\nGO1 72 8 8 69 11.623E-3\nRO1 8 72 86\nGO2 5 72 69 5 11.623E-3\nRO2 72 5 86\nLO 72 7 1E-7\n*\n* MODELS USED\n*\n.MODEL QX NPN(BF=1E4)\n.MODEL DX D(IS=1E-15)\n.ENDS AD633

The netlist it stands for:
* Chua.asc
X§U1 y2 N031 +Vcc -Vcc N030 ADTL082  ; pins In+ In- V+ V- OUT
X§U2 N037 N031 +Vcc -Vcc z2 ADTL082  ; pins In+ In- V+ V- OUT
X§U3 x2 N034 +Vcc -Vcc N026 ADTL082  ; pins In+ In- V+ V- OUT
X§U4 x2 N035 +Vcc -Vcc N027 ADTL082  ; pins In+ In- V+ V- OUT
X§U5 x2 Chua_Out_2 +Vcc -Vcc Chua_Out_2 ADTL082  ; pins In+ In- V+ V- OUT
R1 x2 N026 220 tol=1
R2 N026 N034 220 tol=1
R3 N034 0 2.2k
R4 N027 x2 22k tol=1
R5 N027 N035 22k tol=1
R7 y2 z2 100 tol=1
R8 z2 N031 1k tol=1
R9 N031 N030 1k tol=1
C1 x2 0 10nF
C3 N030 N037 100nF
R10 N037 0 2k tol=1
R11 x2 y2 2k tol=1
C2 y2 0 100nF
C4 +Vcc 0 .1µ
V1 -Vcc 0 -9v
C5 -Vcc 0 .1µ
V2 +Vcc 0 9v
R6 N035 0 3.3k
X§U6 y N029 +Vcc -Vcc N028 ADTL082  ; pins In+ In- V+ V- OUT
X§U7 N036 N029 +Vcc -Vcc z ADTL082  ; pins In+ In- V+ V- OUT
X§U8 x N032 +Vcc -Vcc N024 ADTL082  ; pins In+ In- V+ V- OUT
X§U9 x N033 +Vcc -Vcc N025 ADTL082  ; pins In+ In- V+ V- OUT
X§U10 x Chua_Out +Vcc -Vcc Chua_Out ADTL082  ; pins In+ In- V+ V- OUT
R12 x N024 220 tol=1
R13 N024 N032 220 tol=1
R14 N032 0 2.2k
R15 N025 x 22k tol=1
R16 N025 N033 22k tol=1
R17 y z 100 tol=1
R18 z N029 1k tol=1
R19 N029 N028 1k tol=1
C6 x 0 10nF
C7 N028 N036 100nF
R20 N036 0 2.5k tol=1
R21 x y 2k tol=1
C8 y 0 100nF
R22 N033 0 3.3k
X§U11 NC_01 x +Vcc -Vcc x ADTL082  ; pins In+ In- V+ V- OUT
R23 x2 x 1
X§U12 0 N006 +Vcc -Vcc N007 ADTL084  ; pins In+ In- V+ V- OUT
X§U13 N008 N005 +Vcc -Vcc Decrypt ADTL084  ; pins In+ In- V+ V- OUT
X§U14 0 N001 +Vcc -Vcc InvChua2 ADTL084  ; pins In+ In- V+ V- OUT
R24 N007 N006 10k
R25 N006 Audio_In 10k
R26 N006 N009 10k
R27 Decrypt N005 10k
R28 N008 N007 10k
R29 InvChua2 N001 10k
R30 N001 N002 10k
R31 InvChua2 N005 10k
R32 N008 0 10k
V3 Audio_In 0 SINE(0 200m 1k)
X§U15 Audio_In N003 +Vcc -Vcc N004 ADTL082  ; pins In+ In- V+ V- OUT
R33 N004 N003 100k
R34 0 N003 10k
D1 N004 Arduino_A0 D
C9 Arduino_A0 0 10µ
R35 Arduino_A0 0 100k
R36 N009 Chua_Out 100k
R37 0 N009 4.7k
R38 N002 Chua_Out_2 100k
R39 0 N002 4.7k
C10 N018 N020 10n
R44 N015 N018 320
R48 N020 0 320
C11 N020 0 10n
R49 N019 0 47k
R50 N015 N019 100k
X§U17 N020 N019 +Vcc -Vcc N015 ADTL082  ; pins In+ In- V+ V- OUT
X§U16 N010 0 N013 0 -Vcc 0 Carrier-Chua1 +Vcc AD633
R40 N010 carrier 10k
R41 N010 0 10k
R42 N013 Chua_Out 10k
R43 N013 0 10k
X§U18 N011 0 N014 0 -Vcc 0 Carrier-Chua2 +Vcc AD633
R45 N011 carrier 10k
R46 N011 0 10k
R47 N014 Chua_Out_2 10k
R51 N014 0 10k
X§U19 N015 carrier +Vcc -Vcc carrier ADTL082  ; pins In+ In- V+ V- OUT
X§U20 Carrier-Chua1 0 Audio_In 0 -Vcc 0 Encrypted-Multi +Vcc AD633
X§U21 Gain-Encrypted-Multi 0 Carrier-Chua2 0 -Vcc 0 Decrypted-Multi +Vcc AD633
X§U22 Encrypted-Multi N012 +Vcc -Vcc Gain-Encrypted-Multi ADTL082  ; pins In+ In- V+ V- OUT
R52 Gain-Encrypted-Multi N012 147k
R53 N012 0 1k
X§U23 Decrypted-Multi N016 +Vcc -Vcc Gain-Decrypted-Multi ADTL082  ; pins In+ In- V+ V- OUT
R54 Gain-Decrypted-Multi N016 47k
R55 N016 0 1k
X§U24 N021 Sallen-Low +Vcc -Vcc Sallen-Low ADTL082  ; pins In+ In- V+ V- OUT
R57 N021 N017 8.2k
C12 Sallen-Low N017 0.001µ
C13 0 N021 0.001µ
R56 N017 Gain-Decrypted-Multi 8.2k
X§U25 N023 Filter-Decrypt-Audio +Vcc -Vcc Filter-Decrypt-Audio ADTL082  ; pins In+ In- V+ V- OUT
R58 Filter-Decrypt-Audio N022 32k
R59 0 N023 32k
C14 N023 N022 10n
C15 N022 Sallen-Low 10n
.model D D
.lib standard.dio
.tran 0 10 0 .001
.step param X 100 2.5k 300
* AD633 Analog Multiplier Macro Model
* Description: Amplifier
* Generic Desc: Bipolar, Multiplier, 4 Quadrant
* Developed by: AAG/PMI
* Revision History: 09/15/2014 - Input resistors nodes connection change (RX1A & RY1A)
* 08/10/2012 - Updated to new header style
* 1.0 (12/1993)
* Copyright 1993, 2012 by Analog Devices
*
* Refer to http://www.analog.com/Analog_Root/static/techSupport/designTools/spiceModels/license/spice_general.html for License Statement. Use of this model
* indicates your acceptance of the terms and provisions in the License Statement.
*
* BEGIN Notes:
*
* Not Modeled:
*
* Parameters modeled include:
*
* END Notes
*
* Node assignments
*             X1
*             |  X2
*             |  |  Y1
*             |  |  |  Y2
*             |  |  |  |  VNEG
*             |  |  |  |  |  Z
*             |  |  |  |  |  |  W
*             |  |  |  |  |  |  |  VPOS
*             |  |  |  |  |  |  |  |
.SUBCKT AD633 1  2  3  4  5  6  7  8
*
EREF 100 0 POLY(2) 8 0 5 0 (0,0.5,0.5)
*
* X-INPUT STAGE & POLE AT 15 MHz
*
IBX1 1 0 DC 8E-7
IBX2 2 0 DC 8E-7
EOSX 10 1 POLY(1) (16,100) (5E-3,1)
RX1A 1 11 5E6
RX1B 11 2 5E6
*
GX 100 12 10 2 1E-6
RX 12 100 1E6
CX 12 100 1.061E-14
VX1 8 13 DC 3.05
DX1 12 13 DX
VX2 14 5 DC 3.05
DX2 14 12 DX
*
* COMMON-MODE GAIN NETWORK WITH ZERO AT 560 Hz
*
ECMX 15 100 11 100 10
RCMX1 15 16 1E6
CCMX 15 16 2.8421E-10
RCMX2 16 100 1
*
* Y-INPUT STAGE & POLE AT 15 MHz
*
IBY1 3 0 DC 8E-7
IBY2 4 0 DC 8E-7
EOSY 20 3 POLY(1) (26,100) (5E-3,1)
RY1A 3 21 5E6
RY1B 21 4 5E6
*
GY 100 22 20 4 1E-6
RY 22 100 1E6
CY 22 100 1.061E-14
VY1 8 23 DC 3.05
DY1 22 23 DX
VY2 24 5 DC 3.05
DY2 24 22 DX
*
* COMMON-MODE GAIN NETWORK WITH ZERO AT 560 Hz
*
ECMY 25 100 21 100 10
RCMY1 25 26 1E6
CCMY 25 26 2.8421E-10
RCMY2 26 100 1
*
* Z-INPUT STAGE & POLE AT 15 MHz
*
IBZ1 7 0 DC 8E-7
IBZ2 6 0 DC 8E-7
RZ1 7 6 10E6
*
GZ 100 32 7 6 1E-6
RZ2 32 100 1E6
CZ 32 100 1.061E-14
VZ1 8 33 DC 3.05
DZ1 32 33 DX
VZ2 34 5 DC 3.05
DZ2 34 33 DX
*
* 50-MHz MULTIPLIER CORE & SUMMER
*
GXY 100 40 POLY(2) (12,100) (22,100) (0,0,0,0,0.1E-6)
RXY 40 100 1E6
CXY 40 100 3.1831E-15
*
* OP AMP INPUT STAGE
*
VOOS 59 40 DC 5E-3
Q1 55 32 60 QX
Q2 56 59 61 QX
R1 8 55 3.1831E4
R2 60 54 3.1313E4
R3 8 56 3.1831E4
R4 61 54 3.1313E4
I1 54 5 1E-4
*
* GAIN STAGE & DOMINANT POLE AT 316.23 Hz
*
G1 100 62 55 56 3.141637E-5
R5 62 100 1.0066E8
C3 62 100 5E-12
V1 8 63 DC 4.3399
D1 62 63 DX
V2 64 5 DC 4.3399
D2 64 62 DX
*
* NEGATIVE ZERO AT 20 MHz
*
ENZ 65 100 62 100 1E6
RNZ1 65 66 1
FNZ 65 66 VNC -1
RNZ2 66 100 1E-6
ENC 67 0 65 66 1
CNZ 67 68 7.9577E-9
VNC 68 0 DC 0
*
* POLE AT 4 MHz
*
G2 100 69 66 100 1E-6
R6 69 100 1E6
C2 69 100 3.9789E-14
*
* OP AMP OUTPUT STAGE
*
FSY 8 5 POLY(2) VZC1 VZC2 (2.8286E-3,1,1)
RDC 8 5 28E3
GZC 100 73 72 69 11.623E-3
VZC1 74 100 DC 0
DZC1 73 74 DX
VZC2 100 75 DC 0
DZC2 75 73 DX
VSC1 70 72 0.695
DSC1 69 70 DX
VSC2 72 71 0.695
DSC2 71 69 DX
GO1 72 8 8 69 11.623E-3
RO1 8 72 86
GO2 5 72 69 5 11.623E-3
RO2 72 5 86
LO 72 7 1E-7
*
* MODELS USED
*
.MODEL QX NPN(BF=1E4)
.MODEL DX D(IS=1E-15)
.ENDS AD633
.lib ADI.lib
.lib ADTL084.lib
.backanno
.end